# EAGLE design cc2520 (EAGLE 5.08)
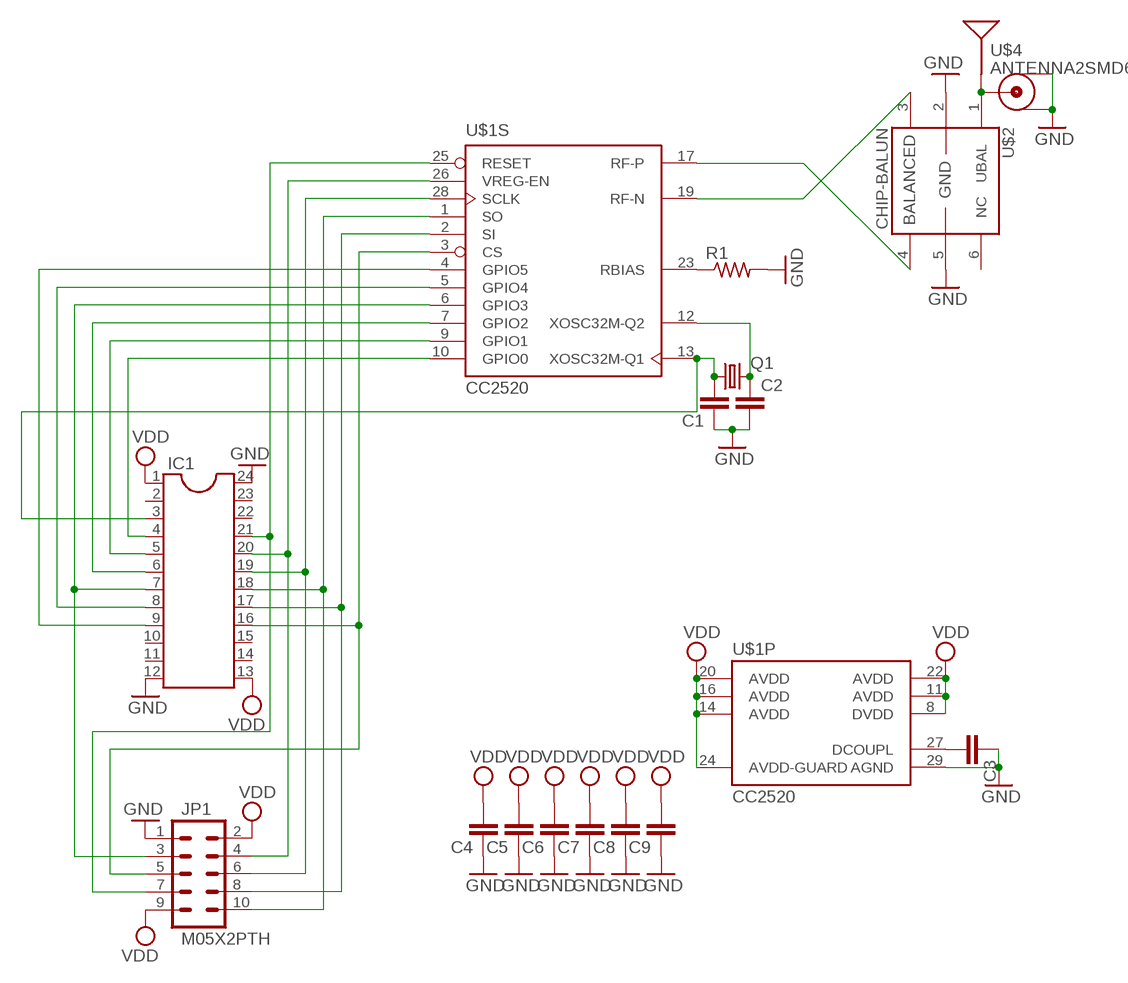
[diagram p0: schematic, sheet 1]

## Parts
C1  C-EUC0402  [C0402]
C2  C-EUC0402  [C0402]
C3  C-EUC0402  [C0402]
C4  C-EUC0402  [C0402]
C5  C-EUC0402  [C0402]
C6  C-EUC0402  [C0402]
C7  C-EUC0402  [C0402]
C8  C-EUC0402  [C0402]
C9  C-EUC0402  [C0402]
IC1  DIL24-6-MOD  [DIL24-6-MOD]
JP1  M05X2PTH  [AVR_ICSP]
Q1  CRYSTAL5X3  [CRYSTAL-SMD-5X3]
R1  R-US_R0402  [R0402]
U$1  CC2520  [QFN50P500X500X100-29N]
U$2  CHIP-BALUN  [EIA0805]
U$3  ANTENNA-COAX  [U.FL]
U$4  ANTENNA2SMD6  [ANTENNA-CHIP6]

## Nets
GND: C1.1 C2.2 C3.1 C4.1 C5.1 C6.1 C7.1 C8.1 C9.1 IC1.12 IC1.24 JP1.1 R1.2 U$1.29(P:AGND) U$2.2(GND1) U$2.5(GND2) U$3.GND1 U$3.GND2
N$1: R1.1 U$1.23(S:RBIAS)
N$3: C2.1 Q1.3 U$1.12(S:XOSC32M-Q2)
N$4: U$1.17(S:RF-P) U$2.4(BAL2)
N$5: U$1.19(S:RF-N) U$2.3(BAL1)
N$6: U$2.1(UBAL) U$3.SIG U$4.1(SIGNAL)
N$7: C3.2 U$1.27(P:DCOUPL)
N$8: IC1.21 JP1.7 U$1.25(S:RESET)
N$9: IC1.20 JP1.4 U$1.26(S:VREG-EN)
N$10: IC1.19 JP1.6 U$1.28(S:SCLK)
N$11: IC1.18 JP1.10 U$1.1(S:SO)
N$12: IC1.17 JP1.8 U$1.2(S:SI)
N$13: IC1.16 JP1.5 U$1.3(S:CS)
N$14: IC1.4 U$1.10(S:GPIO0)
N$15: IC1.5 U$1.9(S:GPIO1)
N$16: IC1.6 U$1.7(S:GPIO2)
N$17: IC1.7 JP1.3 U$1.6(S:GPIO3)
N$18: IC1.8 U$1.5(S:GPIO4)
N$19: IC1.9 U$1.4(S:GPIO5)
VDD: C4.2 C5.2 C6.2 C7.2 C8.2 C9.2 IC1.1 IC1.13 JP1.2 JP1.9 U$1.8(P:DVDD) U$1.11(P:AVDD) U$1.14(P:AVDD) U$1.16(P:AVDD) U$1.20(P:AVDD) U$1.22(P:AVDD) U$1.24(P:AVDD-GUARD)
XTAL-IN: C1.2 IC1.3 Q1.1 U$1.13(S:XOSC32M-Q1)
Unconnected: IC1.2 IC1.10 IC1.11 IC1.14 IC1.15 IC1.22 IC1.23 U$1.15(NC) U$1.18(NC) U$1.21(NC) U$2.6(NC)

## Library data of the parts
C1-C9 = 0common:C-EU: CAPACITOR, European symbol
IC1 = 0common:DIL24: Dual In Line
JP1 = SparkFun:M05X2: Header 5x2 Standard 10-pin dual row 0.1" header. Commonly used with AVR-ISP. Use with Spark Fun Electronics SKU: PRT-00778
Q1 = SparkFun:CRYSTAL: Crystals Various standard crystals. Proven footprints. Spark Fun Electronics SKU : COM-00534
R1 = 0common:R-US_: RESISTOR, American symbol
U$1 = chipcon-ti-v2:CC2520: 2.4 GHZ IEEE 802.15.4/ZIGBEE® RF TRANSCEIVER
U$2 = 0common:CHIP-BALUN
U$3 = 0common:ANTENNA-COAX: Coaxal Antenna Hook-up
U$4 = SparkFun:ANTENNA2: Antenna Single endded antenna. Common with smaller chip antennas. CHIP4 package is the GPS Chip Antenna SKU: GPS-08418. CHIP5 package is 2.4GHz chip antenna SKU: WRL-00144.

## Board
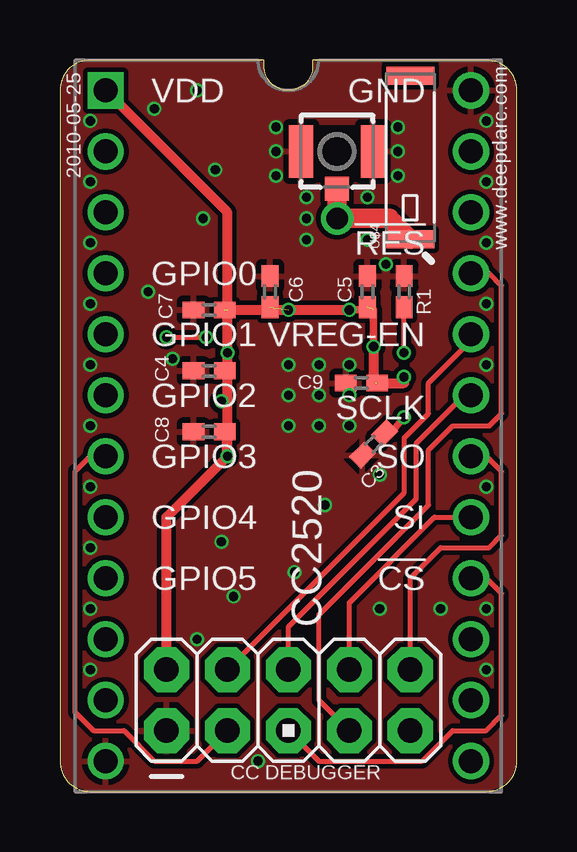
[diagram p1: board, top side]
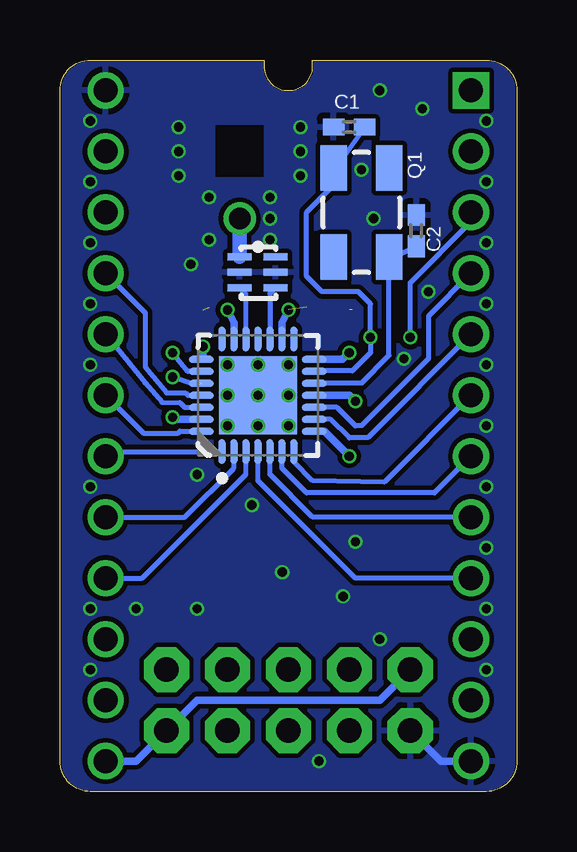
[diagram p2: board, bottom side, seen from below]

Size 19.05 x 30.48 mm. Coordinates in mm from the lower left corner, seen from the top.
Outline: 17.78,0 arc90 19.05,1.27 19.05,29.21 arc90 17.78,30.48 10.54,30.48 10.54,30.23 arc-90 9.53,29.21 arc-90 8.51,30.23 8.51,30.48 1.27,30.48 arc90 0,29.21 0,1.27 arc90 1.27,0 17.78,0
Copper layers (1*16): Top 0.035mm / dielectric 1.5mm / Bottom 0.035mm
Design rules "SparkFun *": minimum track width 8mil, minimum drill 20mil, track to track 0.1969mm, track to pad 0.1969mm, pad to pad 0.1969mm, via to via 0.1969mm, smd to smd 0mil, copper to edge 2mil, drill to drill 8mil, minimum pad ring 10mil, minimum via ring 4mil, stop-mask expansion 4mil, vias tented up to drill 25mil, thermal gap 10mil

### Footprints (pad centres in the part's own frame; a part is rotated, then mirrored left to right if it is on the bottom)
C0402 = smd 0.9 x 0.7: 1 -0.65,0; 2 0.65,0
DIL24-6-MOD = drill 1 square: 1 -13.97,-7.62 | drill 1 round: 2 -11.43,-7.62; 3 -8.89,-7.62; 4 -6.35,-7.62; 5 -3.81,-7.62; 6 -1.27,-7.62; 7 1.27,-7.62; 8 3.81,-7.62; 9 6.35,-7.62; 10 8.89,-7.62; 11 11.43,-7.62; 12 13.97,-7.62; 13 13.97,7.62; 14 11.43,7.62; 15 8.89,7.62; 16 6.35,7.62; 17 3.81,7.62; 18 1.27,7.62; 19 -1.27,7.62; 20 -3.81,7.62; 21 -6.35,7.62; 22 -8.89,7.62; 23 -11.43,7.62; 24 -13.97,7.62
AVR_ICSP = drill 1.016 pad 1.88 octagon: 1 -1.27,5.08; 2 1.27,5.08; 3 -1.27,2.54; 4 1.27,2.54; 5 -1.27,0; 6 1.27,0; 7 -1.27,-2.54; 8 1.27,-2.54; 9 -1.27,-5.08; 10 1.27,-5.08
CRYSTAL-SMD-5X3 = smd 1.9 x 1.1: 1 -1.85,-1.15; 2 1.85,-1.15; 3 1.85,1.15; 4 -1.85,1.15
R0402 = smd 0.9 x 0.7: 1 -0.65,0; 2 0.65,0
QFN50P500X500X100-29N = smd 1.05 x 0.3: 1 -2.35,1.5; 2 -2.35,1; 3 -2.35,0.5; 4 -2.35,0; 5 -2.35,-0.5; 6 -2.35,-1; 7 -2.35,-1.5; 15 2.35,-1.5; 16 2.35,-1; 17 2.35,-0.5; 18 2.35,0; 19 2.35,0.5; 20 2.35,1; 21 2.35,1.5 | smd 0.3 x 1.05: 8 -1.5,-2.35; 9 -1,-2.35; 10 -0.5,-2.35; 11 0,-2.35; 12 0.5,-2.35; 13 1,-2.35; 14 1.5,-2.35; 22 1.5,2.35; 23 1,2.35; 24 0.5,2.35; 25 0,2.35; 26 -0.5,2.35; 27 -1,2.35; 28 -1.5,2.35 | smd 3.25 x 3.25: 29 0,0
EIA0805 = smd 0.3 x 1: 1 0.698,0.765; 2 0.048,0.765; 3 -0.603,0.765; 4 -0.603,-0.735; 5 0.048,-0.735; 6 0.698,-0.735
U.FL = smd 2.2 x 1: GND1 0,1.5; GND2 0,-1.5 | smd 1 x 1: SIG 1.55,0
ANTENNA-CHIP6 = smd 0.75 x 2: 1 -3.4,0; NC 3.4,0

### Placement (x,y rotation side)
C1  6.99,27.69 0 bottom
C2  4.19,23.37 90 bottom
C3  13.08,14.48 45 top
C4  6.22,17.53 0 top
C5  12.83,20.83 270 top
C6  8.76,20.83 270 top
C7  6.22,20.07 0 top
C8  6.22,14.99 0 top
C9  12.57,17.02 0 top
IC1  9.53,15.24 270 top
JP1  9.53,3.81 90 top
Q1  6.48,24.13 270 bottom
R1  14.35,20.83 90 top
U$1  10.79,16.51 90 bottom
U$2  10.79,21.59 90 bottom
U$3  11.56,26.67 270 top
U$4  14.61,26.42 90 top

### Tracks (layer width: path | path; a pad name or v marks a point on that pad's centre or on a via)
GND  (via drill 0.38)
  Bottom 0.305: IC1.12 3.17,1.27 JP1.1
  other vias: 10.79,16.51 10.79,17.78 12.06,17.78 12.06,16.51 12.06,15.24 10.79,15.24 9.53,15.24 9.53,16.51 9.53,17.78 11.05,11.94 6.73,10.41 7.24,8.13 9.78,9.14 4.7,18.03 3.68,20.83 14.1,27.69 14.1,25.65 14.1,26.67 9.02,26.67 9.02,25.65 13.34,7.62 15.88,7.62 1.27,5.08 1.27,7.62 1.27,10.16 17.78,7.62 17.78,5.08 17.78,12.7 17.78,17.78 1.27,12.7 1.27,15.24 1.27,17.78 1.27,20.32 1.27,22.86 1.27,25.4 17.78,20.32 17.78,22.86 17.78,25.4 17.78,27.94 1.27,27.94 13.34,13.21 8.26,1.27 5.71,6.35 9.02,27.69 5.97,23.88 6.48,25.91 3.94,28.45 13.59,21.97 5.71,29.21 10.29,24.77 10.29,23.88 10.29,22.99 12.83,24.77 12.83,22.99
  pour Bottom: 0,30.48 19.05,30.48 19.05,0 0,0
  pour Top: 19.05,30.48 19.05,0 0,0 0,30.48
N$1  (via drill 0.38)
  Top 0.203: v14.35,18.29 R1.1
  Bottom 0.203: U$1.23 13.72,17.51 v14.35,18.29
N$3
  Bottom 0.203: U$1.12 8.44,17.02 6.48,17.02 5.33,18.17 Q1.3 5.26,22.21 C2.1
N$4
  Bottom 0.203: U$1.17 10.29,20.75 U$2.4
N$5
  Bottom 0.203: U$1.19 11.29,20.72 U$2.3
N$6  (via drill 0.9)
  Top 0.813: U$3.SIG v11.56,23.88 13.74,23.88 U$4.1
  Bottom 0.305: U$2.1
  Bottom 0.61: U$2.1 v11.56,23.88
N$7  (via drill 0.38)
  Top 0.305: C3.2 13.79,14.94 v14.35,15.6
  Bottom 0.305: U$1.27 14.34,15.51 v14.35,15.6
N$8
  Top 0.203: JP1.7 10.79,3.81 10.79,7.37 15.37,11.94 15.37,14.22 16.38,15.24 17.91,15.24 18.41,15.75 18.41,21.08 17.91,21.59 IC1.21
  Bottom 0.203: U$1.25 13.72,16.51 13.82,16.61 14.61,16.61 15.49,17.68 15.49,19.94 IC1.21
N$9
  Top 0.203: JP1.4 14.36,12.45 14.36,14.74 15.37,15.75 15.37,17.02 17.4,19.05 IC1.20
  Bottom 0.203: U$1.26 13.85,16.01 14.05,16.2 14.79,16.21 15.5,17.03 IC1.20
N$10
  Top 0.203: JP1.6 9.53,6.86 14.86,12.19 14.86,14.5 16.61,16.26 IC1.19
  Bottom 0.203: U$1.28 14.05,15.01 14.12,14.93 15.57,14.93 IC1.19
N$11
  Top 0.203: JP1.10 14.61,8.89 15.88,10.16 17.91,10.16 18.41,10.67 18.41,13.34 17.78,13.97 IC1.18
  Bottom 0.203: U$1.1 16.95,14.16 IC1.18
N$12
  Top 0.203: JP1.8 12.06,7.87 15.62,11.43 IC1.17
  Bottom 0.203: U$1.2 11.79,13.48 13.84,11.43 IC1.17
N$13
  Top 0.203: JP1.5 10.79,1.27 15.11,1.27 16.38,2.54 17.78,2.54 18.41,3.17 18.41,8.26 17.78,8.89 IC1.16
  Bottom 0.203: U$1.3 11.29,13.22 15.62,8.89 IC1.16
N$14
  Bottom 0.203: U$1.10 7.5,16.01 6.73,15.24 6.47,15.25 3.68,18.03 3.68,19.81 IC1.4
N$15
  Bottom 0.203: U$1.9 7.76,15.51 6.99,14.73 6.21,14.75 IC1.5
N$16
  Bottom 0.203: U$1.7 9.29,13.74 8.51,12.95 5.53,12.89 IC1.6
N$17
  Top 0.203: JP1.3 5.71,1.27 3.94,1.27 2.67,2.54 1.4,2.54 0.64,3.3 0.64,13.34 1.27,13.97 IC1.7
  Bottom 0.203: U$1.6 9.79,13.48 8.76,12.45 3.43,12.45 IC1.7
N$18
  Bottom 0.203: U$1.5 10.29,13.22 8.51,11.43 IC1.8
N$19
  Bottom 0.203: U$1.4 10.79,12.95 6.73,8.89 IC1.9
VDD  (via drill 0.38)  (4 unrouted)
  Top 0.203: C4.2 6.87,17.67 6.99,17.78 | C8.2 6.87,14.08 v6.99,13.97
  Top 0.305: v12.06,20.07 13.08,20.07 v13.08,18.54 | 14.35,17.02 v14.35,17.27
  Top 0.406: IC1.1 6.99,24.13 6.99,20.07 | JP1.2 4.45,11.43 v6.99,13.97 6.99,16.26 | 6.99,16.26 v6.73,16.26 | 6.99,16.26 6.99,17.78 v6.99,18.29 6.99,20.07 | 6.99,20.07 v9.53,20.07 v12.06,20.07 | v13.08,18.54 13.08,17.02 14.35,17.02
  Bottom 0.203: U$1.24 13.56,17.01 v14.35,17.27
  Bottom 0.305: JP1.2 5.71,3.81 13.34,3.81 JP1.9 15.88,1.27 IC1.13 | U$1.14 7.26,18.01 v6.99,18.29 | U$1.11 6.99,16.51 v6.73,16.26 | U$1.8 8.03,15.01 v6.99,13.97 | U$1.16 9.79,19.54 v9.53,20.07 | U$1.20 11.79,19.54 v12.06,20.07 | v13.08,18.54 13.08,18.07 U$1.22
XTAL-IN  (via drill 0.38)
  Top 0.203: v4.45,18.92 v6.1,18.92
  Bottom 0.203: U$1.13 8.43,17.53 6.86,17.53 6.1,18.29 v6.1,18.92 6.1,20.32 6.6,20.83 8.13,20.83 8.76,21.46 8.76,24.13 7.63,25.28 Q1.1 7.38,26.23 C1.2 | IC1.3 1.91,23.75 4.45,21.21 v4.45,18.92

### Text on the board
tNames: 2010-05-25 | GND | www.deepdarc.com | VDD | !RES | GPIO0 | VREG-EN | GPIO1 | SCLK | GPIO2 | SO | GPIO3 | SI | GPIO4 | !CS | GPIO5 | CC2520 | CC DEBUGGER